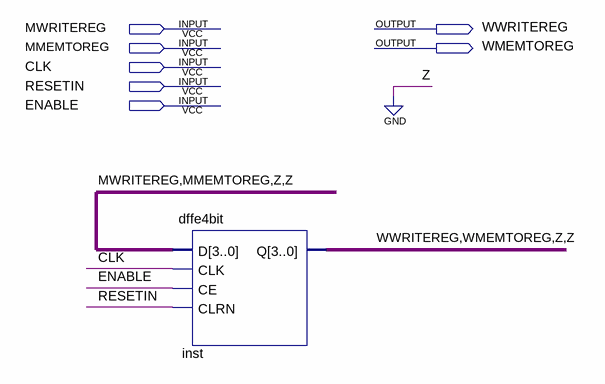
[diagram p0: schematic sheet]
// Quartus schematic MEM-WB-SIGNAL-BUFFER.bdf as structural Verilog: 1 symbols, 7 pins
module \MEM-WB-SIGNAL-BUFFER  (
  input  MWRITEREG,
  input  MMEMTOREG,
  input  CLK,
  input  RESETIN,
  input  ENABLE,
  output WWRITEREG,
  output WMEMTOREG
);

  wire Z;

  dffe4bit inst (
    .D({MWRITEREG, MMEMTOREG, {2{Z}}}), .CLK(CLK), .CE(ENABLE), .CLRN(RESETIN),
    .Q({WWRITEREG, WMEMTOREG, {2{Z}}}));
  // also tied to GND on the sheet: Z
endmodule
